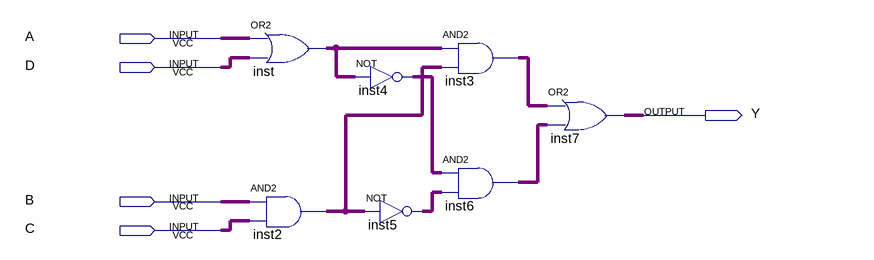
[diagram p0: schematic sheet]
// Quartus schematic labfirstfirst.bdf as structural Verilog: 7 symbols, 5 pins
module labfirstfirst (
  input  A,
  input  D,
  input  B,
  input  C,
  output Y
);

  wire inst2_out, inst3_out, inst4_out, inst5_out, inst6_out, inst_out;

  or inst (inst_out, A, D);
  and inst2 (inst2_out, B, C);
  not inst4 (inst4_out, inst_out);
  not inst5 (inst5_out, inst2_out);
  and inst3 (inst3_out, inst_out, inst2_out);
  and inst6 (inst6_out, inst4_out, inst5_out);
  or inst7 (Y, inst3_out, inst6_out);
endmodule
